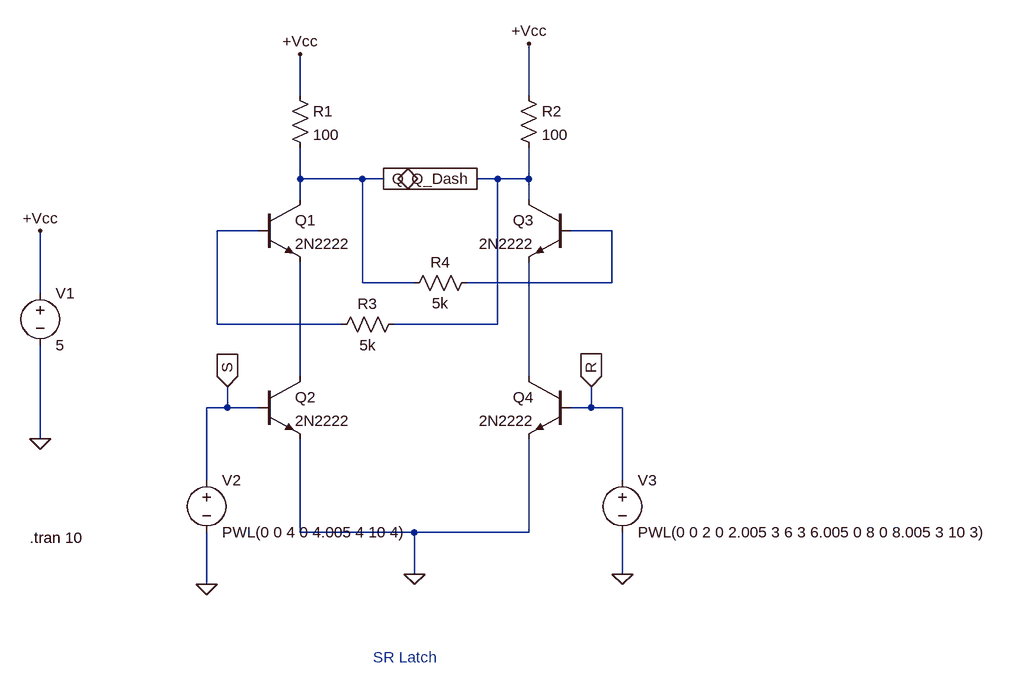
[diagram p0: schematic SR Latch.asc]
SR Latch.asc, the LTspice schematic file:
Version 4
SHEET 1 1296 784
WIRE 192 -96 192 -160
WIRE 544 -96 544 -176
WIRE 192 32 192 -16
WIRE 288 32 192 32
WIRE 320 32 288 32
WIRE 496 32 464 32
WIRE 544 32 544 -16
WIRE 544 32 496 32
WIRE 192 64 192 32
WIRE 544 64 544 32
WIRE 128 112 64 112
WIRE 672 112 608 112
WIRE 288 192 288 32
WIRE 368 192 288 192
WIRE 672 192 672 112
WIRE 672 192 448 192
WIRE -208 208 -208 112
WIRE 64 256 64 112
WIRE 256 256 64 256
WIRE 496 256 496 32
WIRE 496 256 336 256
WIRE 192 336 192 160
WIRE 544 336 544 160
WIRE 80 384 80 352
WIRE 80 384 48 384
WIRE 128 384 80 384
WIRE 640 384 640 352
WIRE 640 384 608 384
WIRE 688 384 640 384
WIRE -208 432 -208 288
WIRE 48 496 48 384
WIRE 688 496 688 384
WIRE 192 576 192 432
WIRE 368 576 192 576
WIRE 544 576 544 432
WIRE 544 576 368 576
WIRE 368 640 368 576
WIRE 688 640 688 576
WIRE 48 656 48 576
FLAG 368 640 0
FLAG 48 656 0
FLAG 688 640 0
FLAG -208 432 0
FLAG -208 112 +Vcc
FLAG 192 -160 +Vcc
FLAG 544 -176 +Vcc
FLAG 320 32 Q
IOPIN 320 32 Out
FLAG 464 32 Q_Dash
IOPIN 464 32 Out
FLAG 80 352 S
IOPIN 80 352 In
FLAG 640 352 R
IOPIN 640 352 In
SYMBOL npn 128 64 R0
SYMATTR InstName Q1
SYMATTR Value 2N2222
SYMBOL npn 128 336 R0
SYMATTR InstName Q2
SYMATTR Value 2N2222
SYMBOL npn 608 64 M0
SYMATTR InstName Q3
SYMATTR Value 2N2222
SYMBOL npn 608 336 M0
SYMATTR InstName Q4
SYMATTR Value 2N2222
SYMBOL voltage -208 192 R0
SYMATTR InstName V1
SYMATTR Value 5
SYMBOL voltage 48 480 R0
WINDOW 123 0 0 Left 0
WINDOW 39 0 0 Left 0
SYMATTR InstName V2
SYMATTR Value PWL(0 0 4 0 4.005 4 10 4)
SYMBOL voltage 688 480 R0
WINDOW 123 0 0 Left 0
WINDOW 39 0 0 Left 0
SYMATTR InstName V3
SYMATTR Value PWL(0 0 2 0 2.005 3 6 3 6.005 0 8 0 8.005 3 10 3)
SYMBOL res 176 -112 R0
SYMATTR InstName R1
SYMATTR Value 100
SYMBOL res 528 -112 R0
SYMATTR InstName R2
SYMATTR Value 100
SYMBOL res 352 240 R90
WINDOW 0 0 56 VBottom 2
WINDOW 3 32 56 VTop 2
SYMATTR InstName R3
SYMATTR Value 5k
SYMBOL res 464 176 R90
WINDOW 0 0 56 VBottom 2
WINDOW 3 32 56 VTop 2
SYMATTR InstName R4
SYMATTR Value 5k
TEXT -224 584 Left 2 !.tran 10
TEXT 304 768 Left 2 ;SR Latch

The netlist it stands for:
* SR Latch.asc
Q1 Q N001 N003 0 2N2222
Q2 N003 S 0 0 2N2222
Q3 Q_Dash N002 N004 0 2N2222
Q4 N004 R 0 0 2N2222
V1 +Vcc 0 5
V2 S 0 PWL(0 0 4 0 4.005 4 10 4)
V3 R 0 PWL(0 0 2 0 2.005 3 6 3 6.005 0 8 0 8.005 3 10 3)
R1 +Vcc Q 100
R2 +Vcc Q_Dash 100
R3 Q_Dash N001 5k
R4 N002 Q 5k
.model NPN NPN
.model PNP PNP
.lib standard.bjt
.tran 10
* SR Latch
.backanno
.end